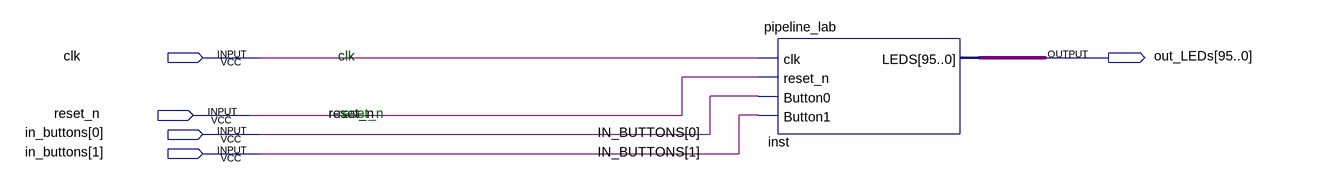
[diagram p0: schematic sheet]
// Quartus schematic GECKO.bdf as structural Verilog: 1 symbols, 5 pins
module GECKO (
  input  clk,
  input  reset_n,
  input  [1:0] in_buttons,
  output [95:0] out_LEDs
);

  pipeline_lab inst (.clk(clk), .reset_n(reset_n), .Button0(in_buttons[0]), .Button1(in_buttons[1]), .LEDS(out_LEDs));

  // Notes on the sheet:
  //   clk
  //   reset_n
endmodule
